# Altium schematic sheet HardwareSchematicv2.SchDoc
size A4; SheetNumber: 1; SheetTotal: 2
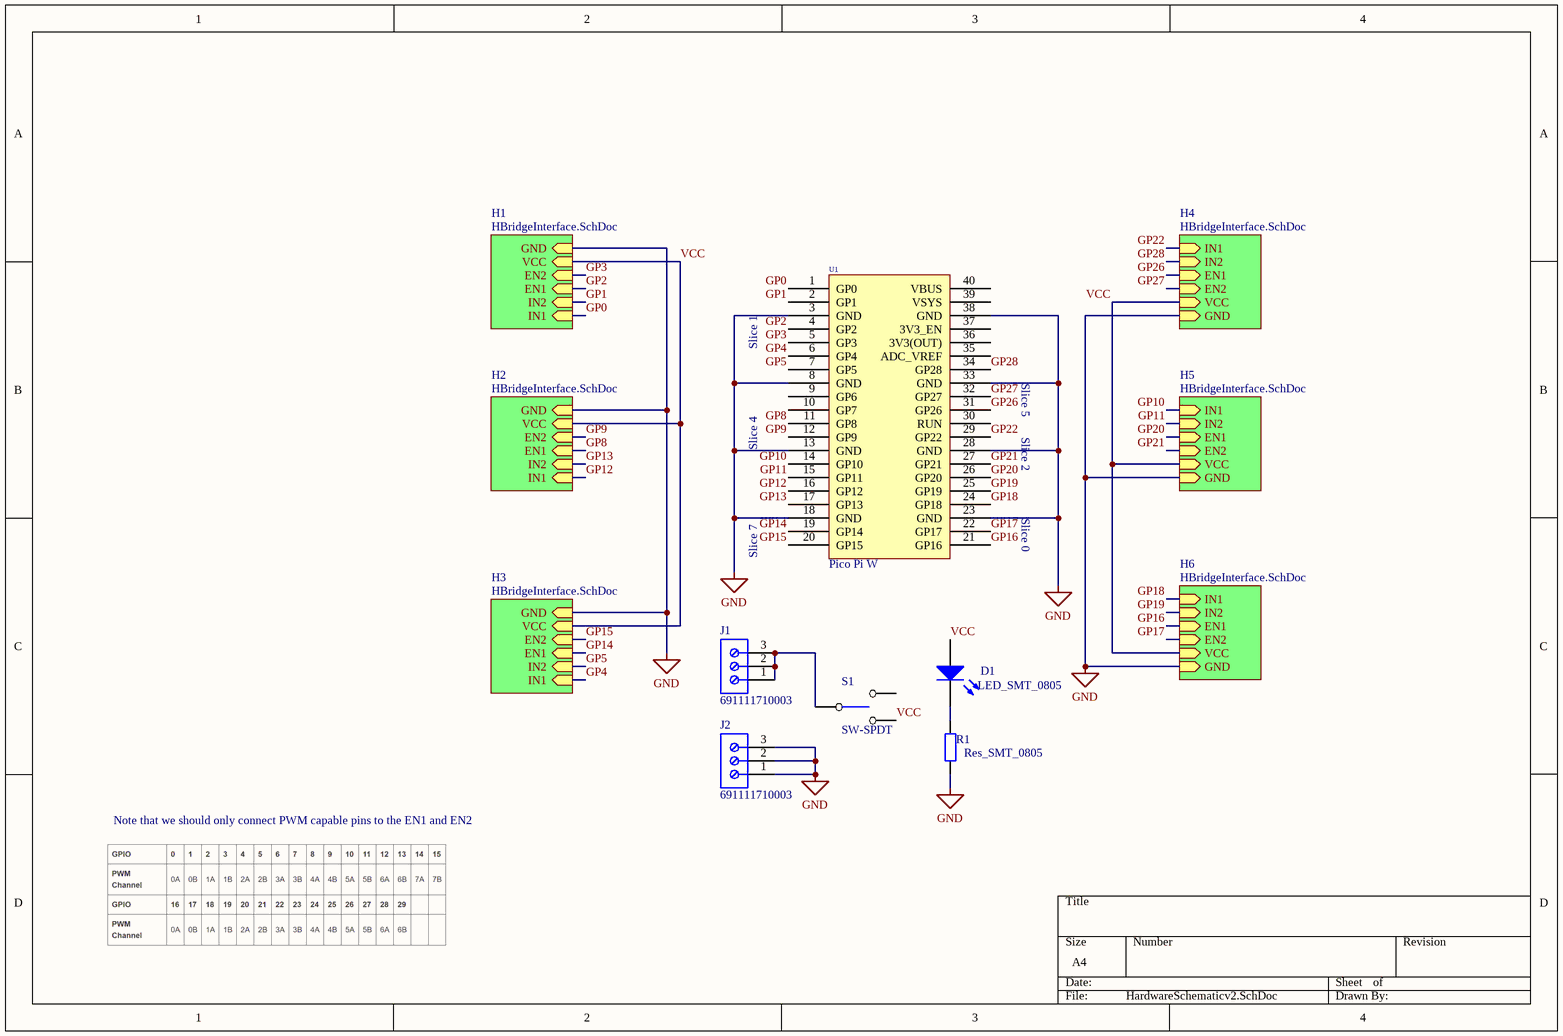
[diagram p0: HardwareSchematicv2.SchDoc]

## Parts
D1  LED_SMT_0805  [0805 LED]
J1  691111710003  [691111710003]
J2  691111710003  [691111710003]
R1  Res_SMT_0805  [0805 RES]
S1  SW-SPDT  [SW-SPDT]
U1  Pico Pi W  [New footprint 1]

## Sub-sheets
H1 = HBridgeInterface.SchDoc: IN1 (in), IN2 (in), EN1 (in), EN2 (in), VCC (in), GND (in)
H2 = HBridgeInterface.SchDoc: IN1 (in), IN2 (in), EN1 (in), EN2 (in), VCC (in), GND (in)
H3 = HBridgeInterface.SchDoc: IN1 (in), IN2 (in), EN1 (in), EN2 (in), VCC (in), GND (in)
H4 = HBridgeInterface.SchDoc: IN1 (in), IN2 (in), EN1 (in), EN2 (in), VCC (in), GND (in)
H5 = HBridgeInterface.SchDoc: IN1 (in), IN2 (in), EN1 (in), EN2 (in), VCC (in), GND (in)
H6 = HBridgeInterface.SchDoc: IN1 (in), IN2 (in), EN1 (in), EN2 (in), VCC (in), GND (in)

## Nets
GND: J2.1 J2.2 J2.3 R1.2 U1.3(GND) U1.8(GND) U1.13(GND) U1.18(GND) U1.23(GND) U1.28(GND) U1.33(GND) U1.38(GND) ; sheet H1/GND, sheet H2/GND, sheet H3/GND, sheet H4/GND, sheet H5/GND, sheet H6/GND
GP0: U1.1(GP0) ; sheet H1/IN1
GP1: U1.2(GP1) ; sheet H1/IN2
GP2: U1.4(GP2) ; sheet H1/EN1
GP3: U1.5(GP3) ; sheet H1/EN2
GP4: U1.6(GP4) ; sheet H3/IN1
GP5: U1.7(GP5) ; sheet H3/IN2
GP8: U1.11(GP8) ; sheet H2/EN1
GP9: U1.12(GP9) ; sheet H2/EN2
GP10: U1.14(GP10) ; sheet H5/IN1
GP11: U1.15(GP11) ; sheet H5/IN2
GP12: U1.16(GP12) ; sheet H2/IN1
GP13: U1.17(GP13) ; sheet H2/IN2
GP14: U1.19(GP14) ; sheet H3/EN1
GP15: U1.20(GP15) ; sheet H3/EN2
GP16: U1.21(GP16) ; sheet H6/EN1
GP17: U1.22(GP17) ; sheet H6/EN2
GP18: U1.24(GP18) ; sheet H6/IN1
GP19: U1.25(GP19) ; sheet H6/IN2
GP20: U1.26(GP20) ; sheet H5/EN1
GP21: U1.27(GP21) ; sheet H5/EN2
GP22: U1.29(GP22) ; sheet H4/IN1
GP26: U1.31(GP26) ; sheet H4/EN1
GP27: U1.32(GP27) ; sheet H4/EN2
GP28: U1.34(GP28) ; sheet H4/IN2
VCC: D1.1(A) S1.3 ; sheet H1/VCC, sheet H2/VCC, sheet H3/VCC, sheet H4/VCC, sheet H5/VCC, sheet H6/VCC
NetD1_2: D1.2(K) R1.1
NetJ1_1: J1.1 J1.2 J1.3 S1.2

Not connected (* = marked no-connect by the designer): S1 1; U1 9(GP6) 10(GP7) 30(RUN) 35(ADC_VREF) 36(3V3(OUT)) 37(3V3_EN) 39(VSYS) 40(VBUS)

## Notes on the sheet
- Slice 1
- Slice 5
- Slice 4
- Slice 2
- Slice 0
- Slice 7
- Note that we should only connect PWM capable pins to the EN1 and EN2

## Library data of the parts
D1 = CMP-016-000004-1: SMT LED 0805 size; Manufacturer Part Number: LTST-C170KGKT; Manufacturer: Lite-On Inc.; Wavelength - Dominant: 571nm; Viewing Angle: 130°; Lens Transparency: Clear; Lens Color: Colorless; Lens Style/Size: Rectangle with Flat Top, 1.40mm x 1.25mm; Millicandela Rating: 35mcd; Voltage - Forward (Vf) (Typ): 2V; Wavelength - Peak: 574nm; Current - Test: 20mA; Color: Green; Design Item ID: LED_SMT_0805; Height (Max): 1.10mm; Mounting Type: Surface Mount; Package / Case: 0805 (2012 Metric); ComponentLink1URL: http://optoelectronics.liteon.com/upload/download/DS22-2000-073/LTST-C170KGKT.pdf; Category: Optoelectronics; Component Type: Standard; Pricing 1: 1=0.62, 10=0.459, 25=0.338, 100=0.2415, 250=0.16416, 500=0.14486, 1000=0.11347 (NZD); Packaging: Cut Tape (CT); Stock 1: 503069; ComponentLink1Description: http://optoelectronics.liteon.com/upload/download/DS22-2000-073/LTST-C170KGKT.pdf; Source: EE209_SchLib.SchLib; Features: -; Part Status: Active; Size / Dimension: 2.00mm L x 1.25mm W; Pin Count: 2; RoHS: RoHS Compliant
J1 J2 = CMP-1502-03263-2: NexarPartId: 8917709; Wire/Cable Gauge: 26AWG; Wire Gauge (Min): 14AWG; Plating: Steel; Pitch: 5.0038mm; Current: 8A; Number of Positions Per Level: 3; Number of Levels: 1; Voltage Rating: 300V; Stripping Length: -6mm; Length: 7.6mm; Lead Pitch: 5mm; Color: Green; Termination: Screw; Wire Gauge (Max): 26AWG; Max Operating Temperature: 105°C; RoHS: Compliant; Width: 16.2mm; REACH SVHC: Unknown; Current Rating: 8A; Packaging: Box; Contact Material: Brass; Contact Plating: Tin; Number of Contacts: 3; Voltage: 300V; Height: 14mm; Number of Pins: 3; Mount: Through Hole; Min Operating Temperature: -40°C; Housing Material: Nylon
R1 = CMP-019-000000-1: 0805 resistor; LatestRevisionDate: 17-Jul-2002; Source: EE209_SchLib.SchLib; Publisher: Altium Limited; Component Type: Standard; Value: *; Pin Count: 2; Design Item ID: Res_SMT_0805; PackageReference: AXIAL-0.4; LatestRevisionNote: Re-released for DXP Platform.; Published: 8-Jun-2000
S1 = CMP-025-000001-1: Toggle Switch; Source: COMSYS301.SCHLIB; Pin Count: 3; Component Type: Standard; Design Item ID: SW-SPDT
U1 = Pico-Pi-W-1: micro